# Altium project ADC.PrjPcb
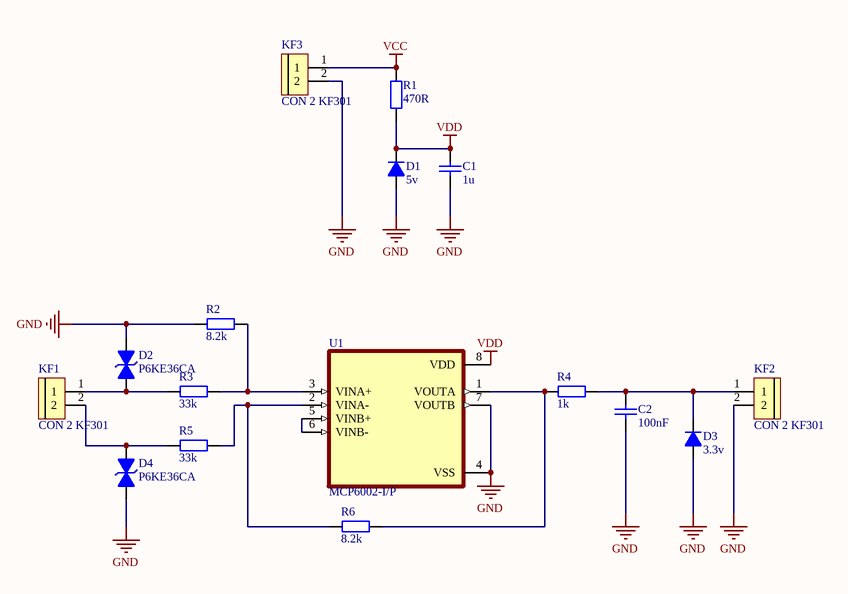
[diagram p0: Sheet1.SchDoc]
1 sheet, 16 parts. Net scope: global (net labels, ports and power ports of the same name join across sheets).
Board file: PCB1.PcbDoc

## Sheet Sheet1.SchDoc
size A; SheetNumber: 1; SheetTotal: 1

### Parts
C1  1u  [tu gom]
C2  100nF  [tu gom]
D1  5v  [DIODE 1A]
D2  P6KE36CA  [DIODE 1A]
D3  3.3v  [DIODE 1A]
D4  P6KE36CA  [DIODE 1A]
KF1  CON 2 KF301  [Con 2 KF301 5.08]
KF2  CON 2 KF301  [Con 2 KF301 5.08]
KF3  CON 2 KF301  [Con 2 KF301 5.08]
R1  470R  [tro vach 1/2w]
R2  8.2k  [tro vach 1/2w]
R3  33k  [tro vach 1/2w]
R4  1k  [tro vach 1/2w]
R5  33k  [tro vach 1/2w]
R6  8.2k  [tro vach 1/2w]
U1  MCP6002-I/P  [DIP787W46P254L927H533Q8]

### Nets
GND: C1.2 C2.2 D1.1(A) D2.1(A) D3.1(A) D4.2(K) KF2.2 KF3.2 R2.2 U1.4(VSS) U1.7(VOUTB)
VCC: KF3.1 R1.1
VDD: C1.1 D1.2(K) R1.2 U1.8(VDD)
NetC2_1: C2.1 D3.2(K) KF2.1 R4.2
NetD2_2: D2.2(K) KF1.1 R3.1
NetD4_1: D4.1(A) KF1.2 R5.1
NetR2_1: R2.1 R3.2 U1.3(VINA+)
NetR4_1: R4.1 R6.2 U1.1(VOUTA)
NetR5_2: R5.2 R6.1 U1.2(VINA-)
NetU1_5: U1.5(VINB+) U1.6(VINB-)

### Library data of the parts
C1 C2 = Tu gom 15pF 50V: Cắm; Don_Vi: Con; So_Chan: 2; Ten_Linh_Kien: Tụ gốm 15P 50V; Ma_Hang: MH004767; Chung_Loai: Cắm; Kieu_Chan: *
D1 D3 = Diode 1N4007: Cắm; Ten_Linh_Kien: Diode 1N4007 1A (DIP); Don_Vi: Con; Ma_Hang: MH001063; Ghi Chu: *; Kieu_Chan: *; Chung_Loai: Cắm
D2 D4 = Diode P6KE36CA: TVS Diodes P6KE36CA 600W 36V DO-15 (DO-204AC)
KF1-KF3 = CON 2 KF301: Cắm; Ma_Hang: MH000987; Ten_Linh_Kien: CON 2 KF301-2P 5.08MM Xanh Dương; Chung_Loai: Cắm; Ghi_Chu: *; Kieu_Chan: *; Don_Vi: Con
R1-R6 = Tro Vach 1/2W 5% 0.22R: Cắm; So_Chan: 2; Ten_Linh_Kien: Trở 5% 1/2w 0.22R; Ma_Hang: MH006031; Don_Vi: Con; Chung_Loai: Cắm; Kieu_Chan: *
U1 = MCP6002-I/P: Microchip ,Dual Op Amp,1MHz CMOS,Rail to Rail,3V,5V,8-Pin PDIP | Microchip Technology Inc. MCP6002-I/P; SnapEDA_Link: https://www.snapeda.com/parts/MCP6002-I/P/Microchip+Technology/view-part/?ref=snap; Package: DIP-8 Microchip; Value: *; MF: Microchip; MP: MCP6002-I/P; Check_prices: https://www.snapeda.com/parts/MCP6002-I/P/Microchip+Technology/view-part/?ref=eda